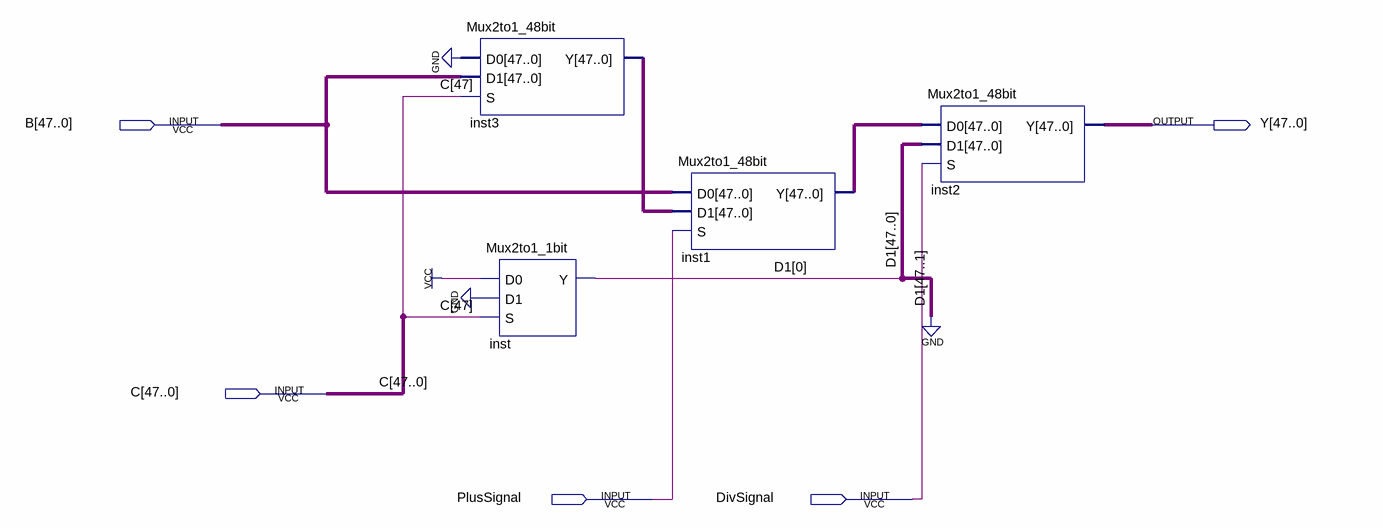
[diagram p0: schematic sheet]
// Quartus schematic ChonDauVaoALUChia.bdf as structural Verilog: 4 symbols, 5 pins
module ChonDauVaoALUChia (
  input  [47:0] B,
  input  [47:0] C,
  input  PlusSignal,
  input  DivSignal,
  output [47:0] Y
);

  wire [0:0] D1;
  wire [47:0] inst1_y, inst3_y;

  Mux2to1_48bit inst3 (.D0({48{1'b0}}), .D1(B), .S(C[47]), .Y(inst3_y));
  Mux2to1_1bit inst (.D0(1'b1), .D1(1'b0), .S(C[47]), .Y(D1[0]));
  Mux2to1_48bit inst1 (.D0(B), .D1(inst3_y), .S(PlusSignal), .Y(inst1_y));
  Mux2to1_48bit inst2 (.D0(inst1_y), .D1({{47{1'b0}}, D1[0]}), .S(DivSignal), .Y(Y));
endmodule
